# Altium project WindingOne.PrjPcb
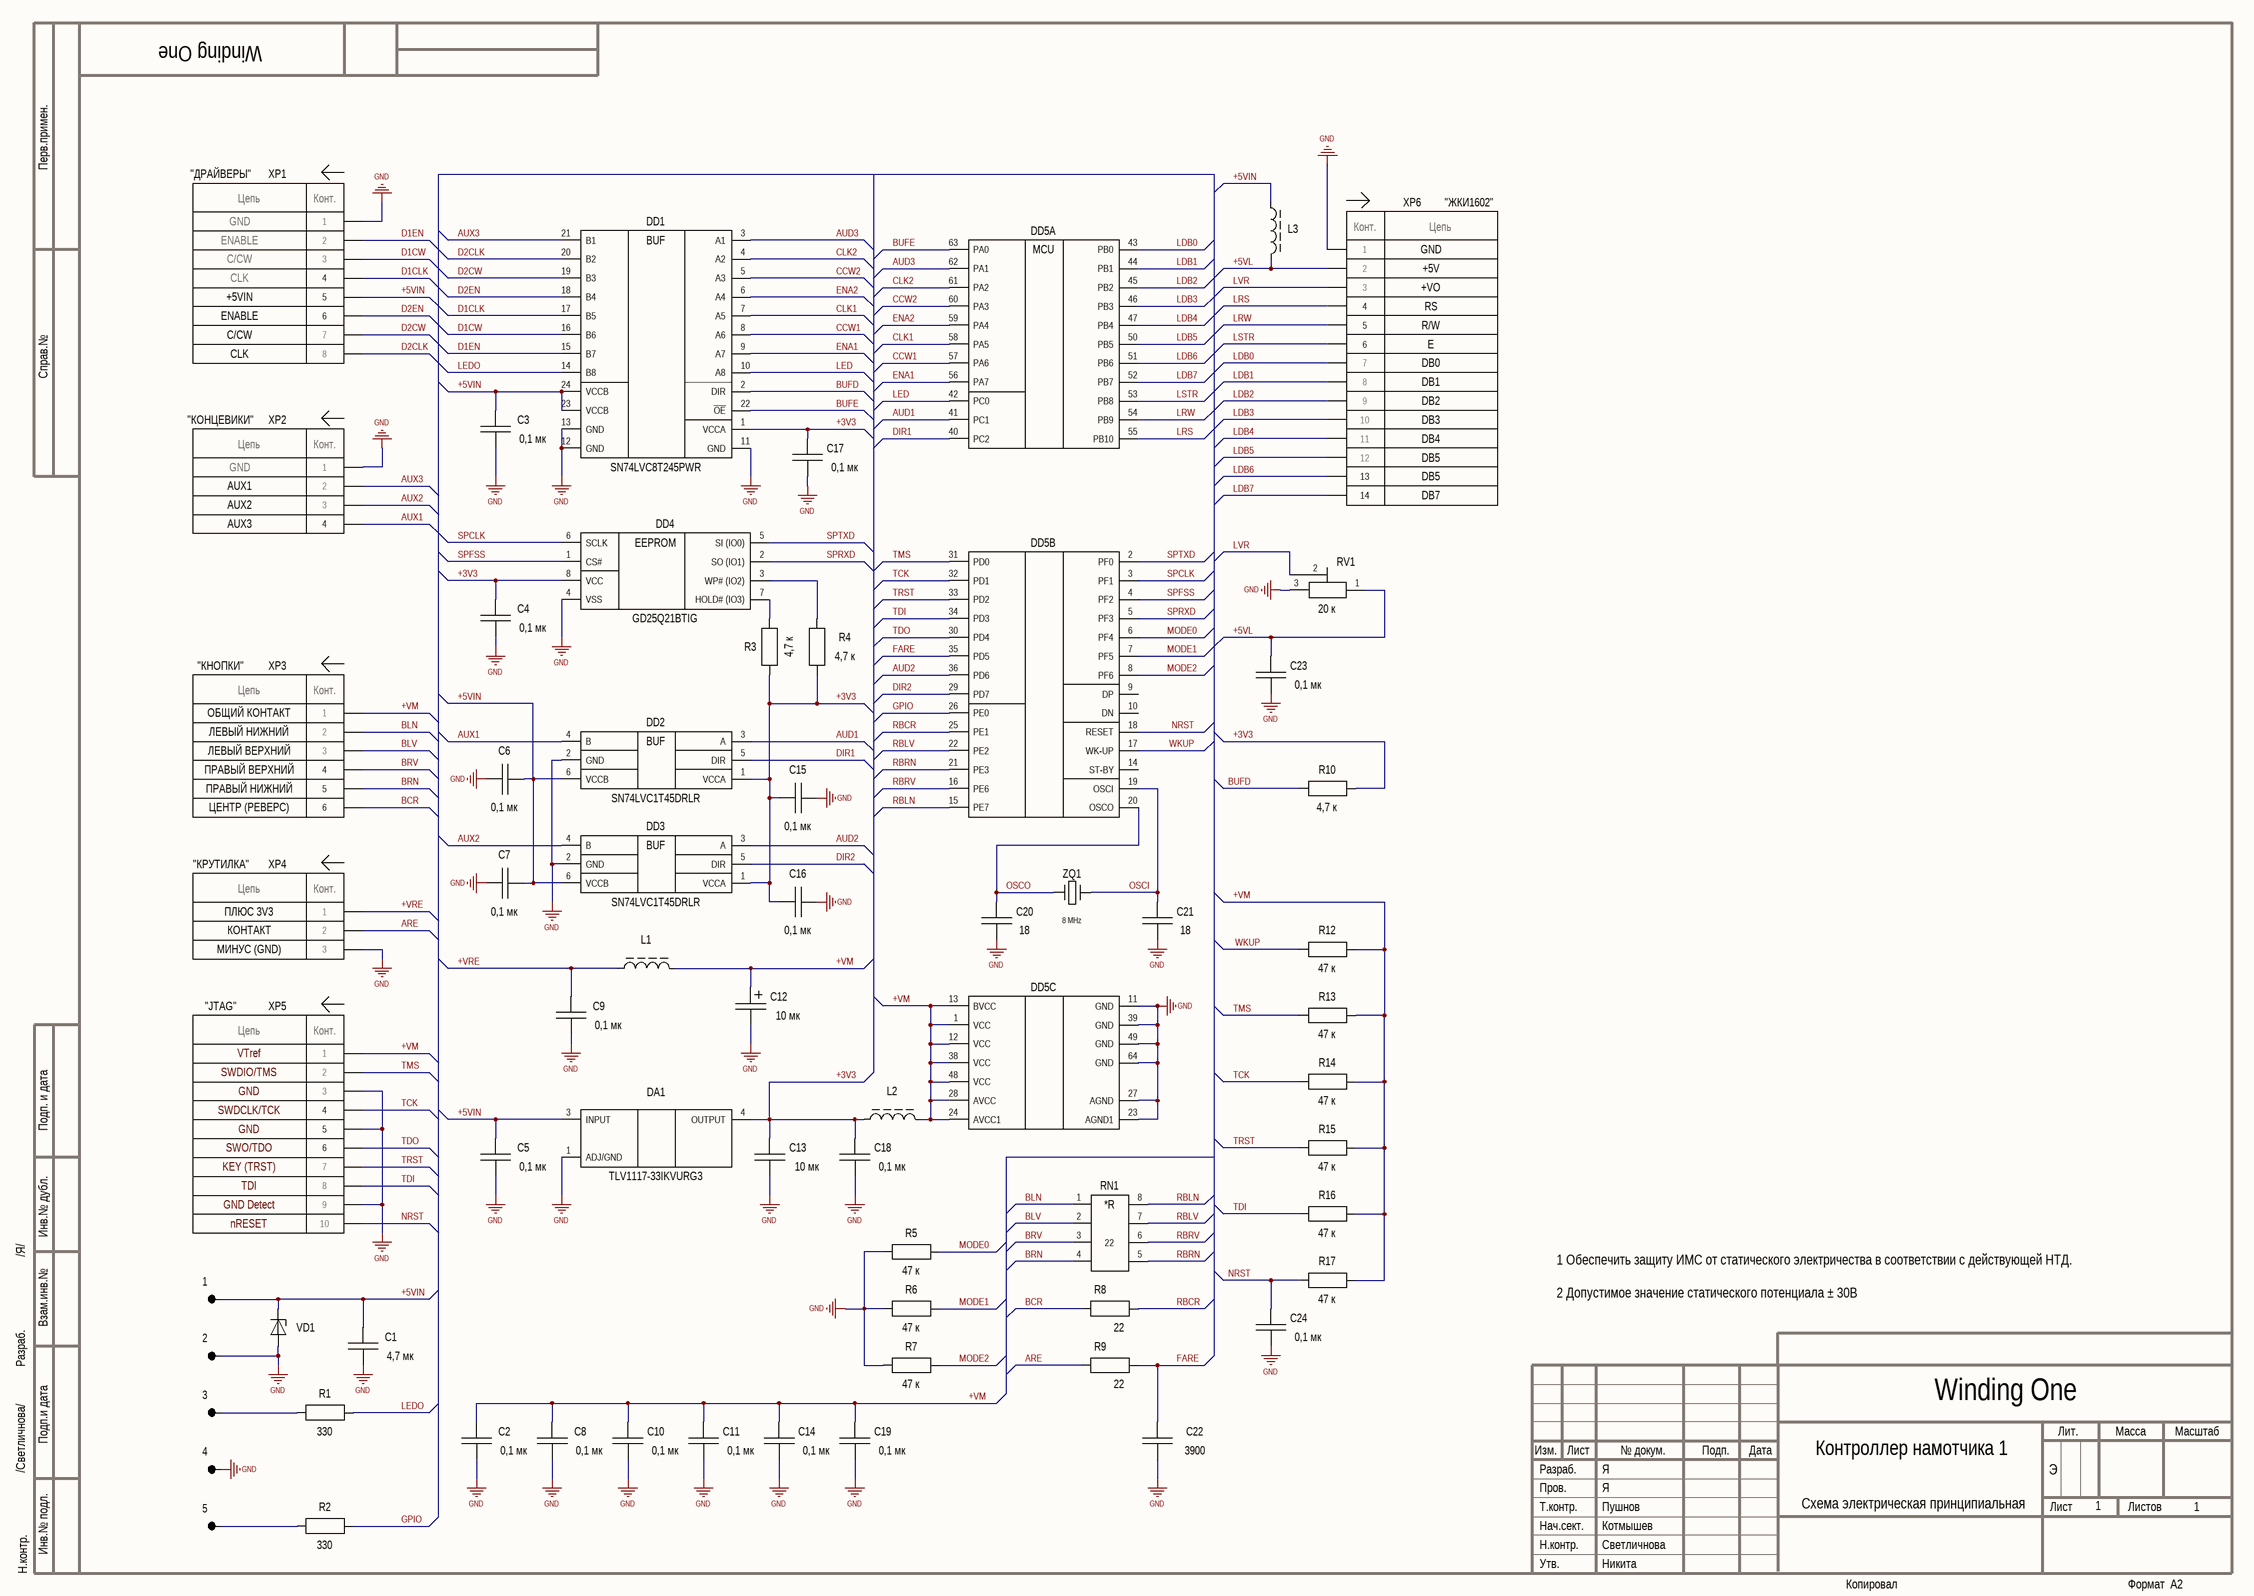
[diagram p0: Wctrl-v1.SchDoc]
1 sheet, 64 parts. Net scope: global (net labels, ports and power ports of the same name join across sheets).
Board file: Wctrl-pcb1.PcbDoc

## Sheet Wctrl-v1.SchDoc
size 594 x 420 mm; ApprovedBy: Никита; CheckedBy: Я; Author: Я; DrawnBy: Светличнова; Engineer: Пушнов; SheetNumber: 1; SheetTotal: 1; Обозначение: Winding One; Литера: Э; Наименование: Контроллер намотчика 1; SchematicType: Схема электрическая принципиальная; HeadOfSector: Котмышев

### Parts
1  Точка пайки  [Pad X 1.0 Round]  (value not drawn)  (no BOM)
2  Точка пайки  [Pad X 1.0 Round]  (value not drawn)  (no BOM)
3  Точка пайки  [Pad X 1.0 Round]  (value not drawn)  (no BOM)
4  Точка пайки  [Pad X 1.0 Round]  (value not drawn)  (no BOM)
5  Точка пайки  [Pad X 1.0 Round]  (value not drawn)  (no BOM)
C1  Capacitance: 4,7 мк  [GRM31C R1]  (hidden comment: GRM31CR71E475K)
C2  Capacitance: 0,1 мк  [CAPC 0805 T1]  (hidden comment: GRM21BR71H104K)
C3  Capacitance: 0,1 мк  [CAPC 0805 T1]  (hidden comment: GRM21BR71H104K)
C4  Capacitance: 0,1 мк  [CAPC 0805 T1]  (hidden comment: GRM21BR71H104K)
C5  Capacitance: 0,1 мк  [CAPC 0805 T1]  (hidden comment: GRM21BR71H104K)
C6  Capacitance: 0,1 мк  [CAPC 0805 T1]  (hidden comment: GRM21BR71H104K)
C7  Capacitance: 0,1 мк  [CAPC 0805 T1]  (hidden comment: GRM21BR71H104K)
C8  Capacitance: 0,1 мк  [CAPC 0805 T1]  (hidden comment: GRM21BR71H104K)
C9  Capacitance: 0,1 мк  [CAPC 0805 T1]  (hidden comment: GRM21BR71H104K)
C10  Capacitance: 0,1 мк  [CAPC 0805 T1]  (hidden comment: GRM21BR71H104K)
C11  Capacitance: 0,1 мк  [CAPC 0805 T1]  (hidden comment: GRM21BR71H104K)
C12  Capacitance: 10 мк  [К53-68-C]  (hidden comment: К53-68 "C"-20В-10 мкФ±10%)
C13  Capacitance: 10 мк  [GRM31C R1]  (hidden comment: GRM31CR71C106K)
C14  Capacitance: 0,1 мк  [CAPC 0805 T1]  (hidden comment: GRM21BR71H104K)
C15  Capacitance: 0,1 мк  [CAPC 0805 T1]  (hidden comment: GRM21BR71H104K)
C16  Capacitance: 0,1 мк  [CAPC 0805 T1]  (hidden comment: GRM21BR71H104K)
C17  Capacitance: 0,1 мк  [CAPC 0805 T1]  (hidden comment: GRM21BR71H104K)
C18  Capacitance: 0,1 мк  [CAPC 0805 T1]  (hidden comment: GRM21BR71H104K)
C19  Capacitance: 0,1 мк  [CAPC 0805 T1]  (hidden comment: GRM21BR71H104K)
C20  Capacitance: 18  [CAPC 0603 T1]  (hidden comment: GRM1885C1H180J)
C21  Capacitance: 18  [CAPC 0603 T1]  (hidden comment: GRM1885C1H180J)
C22  Capacitance: 3900  [CAPC 0805 T1]  (hidden comment: GRM2165C1H392J)
C23  Capacitance: 0,1 мк  [CAPC 0805 T1]  (hidden comment: GRM21BR71H104K)
C24  Capacitance: 0,1 мк  [CAPC 0805 T1]  (hidden comment: GRM21BR71H104K)
DA1  TLV1117-33IKVURG3  [TO-252_TI_KVU (KVU0003A)_R1]
DD1  SN74LVC8T245PWR  [TSSOP24_TI_PW (PW0024A)]
DD2  SN74LVC1T45DRLR  [SOT-5x3_TI_DRL(R-PDSO-N6)]
DD3  SN74LVC1T45DRLR  [SOT-5x3_TI_DRL(R-PDSO-N6)]
DD4  GD25Q21BTIG  [SOIC-8 IPC N]
DD5  К1986ВЕ92QI  [К1986ВЕ92QI]  (value not drawn)  (parts A,B,C of 3)
L1  Дроссель BLM  [INDC2012X10N]  (value not drawn)
L2  Дроссель BLM  [INDC2012X10N]  (value not drawn)
L3  Дроссель BLM  [INDC2012X10N]  (value not drawn)
R1  Resistance: 330  [IEC 2012N]  (hidden comment: Резистор)
R2  Resistance: 330  [IEC 2012N]  (hidden comment: Резистор)
R3  Resistance: 4,7 к  [IEC 2011N]  (hidden comment: Резистор)
R4  Resistance: 4,7 к  [IEC 2011N]  (hidden comment: Резистор)
R5  Resistance: 47 к  [IEC 2011N]  (hidden comment: Резистор)
R6  Resistance: 47 к  [IEC 2011N]  (hidden comment: Резистор)
R7  Resistance: 47 к  [IEC 2011N]  (hidden comment: Резистор)
R8  Resistance: 22  [IEC 2011N]  (hidden comment: Резистор)
R9  Resistance: 22  [IEC 2011N]  (hidden comment: Резистор)
R10  Resistance: 4,7 к  [IEC 2011N]  (hidden comment: Резистор)
R12  Resistance: 47 к  [IEC 2011N]  (hidden comment: Резистор)
R13  Resistance: 47 к  [IEC 2011N]  (hidden comment: Резистор)
R14  Resistance: 47 к  [IEC 2011N]  (hidden comment: Резистор)
R15  Resistance: 47 к  [IEC 2011N]  (hidden comment: Резистор)
R16  Resistance: 47 к  [IEC 2011N]  (hidden comment: Резистор)
R17  Resistance: 47 к  [IEC 2011N]  (hidden comment: Резистор)
RN1  Resistance: 22  [НР1-2Р V1]  (hidden comment: CAT16-220J4LF)
RV1  Resistance: 20 к  [3313J-1]  (hidden comment: Резистор подстроечный)
VD1  Стабилитрон  [SMBJ-LF-R1]  (value not drawn)
XP1  Назначение: "ДРАЙВЕРЫ"  [СНП346-8ВП21-1]  (hidden comment: X8 Connector XP)
XP2  Назначение: "КОНЦЕВИКИ"  [СНП346-4ВП21-1]  (hidden comment: X4 Connector XP)
XP3  Назначение: "КНОПКИ"  [СНП346-6ВП21-1]  (hidden comment: X6 Connector XP)
XP4  Назначение: "КРУТИЛКА"  [СНП346-3ВП21-1]  (hidden comment: X3 Connector XP)
XP5  Назначение: "JTAG"  [DS1014-10SF1B]  (hidden comment: X10 Connector XP)
XP6  Назначение: "ЖКИ1602"  [DS1025-01-1X14]  (hidden comment: X14 Connector XP)
ZQ1  Частота: 8 MHz  [HC-49S AS TXC]  (hidden comment: Кварц 2к)

### Nets
GND: 2.1 4.1 C1.1 C2.1 C3.1 C4.1 C5.1 C6.2 C7.2 C8.1 C9.1 C10.1 C11.1 C12.2 C13.1 C14.1 C15.1 C16.1 C17.1 C18.1 C19.1 C20.1 C21.1 C22.1 C23.1 C24.1 DA1.1(ADJ/GND) DD1.11(GND) DD1.12(GND) DD1.13(GND) DD2.2(GND) DD3.2(GND) DD4.4(VSS) DD5.11(GND) DD5.23(AGND1) DD5.27(AGND) DD5.39(GND) DD5.49(GND) DD5.64(GND) R5.1 R6.1 R7.1 RV1.3 VD1.2(Анод) XP1.1 XP2.1 XP4.3 XP5.3 XP5.5 XP5.9 XP6.1
+3V3: C4.2 C13.2 C15.2 C16.2 C17.2 C18.2 DA1.4(OUTPUT) DD1.1(VCCA) DD2.1(VCCA) DD3.1(VCCA) DD4.8(VCC) L2.1 R3.1 R4.1 R10.2
+5VIN: 1.1 C1.2 C3.2 C5.2 C6.1 C7.1 DA1.3(INPUT) DD1.23(VCCB) DD1.24(VCCB) DD2.6(VCCB) DD3.6(VCCB) L3.1 VD1.1(Катод) XP1.5
+5VL: C23.2 L3.2 RV1.1 XP6.2
+VM: C2.2 C8.2 C10.2 C11.2 C12.1 C14.2 C19.2 DD5.1(VCC) DD5.12(VCC) DD5.13(BVCC) DD5.24(AVCC1) DD5.28(AVCC) DD5.38(VCC) DD5.48(VCC) L1.2 L2.2 R12.2 R13.2 R14.2 R15.2 R16.2 R17.2 XP3.1 XP5.1
+VRE: C9.2 L1.1 XP4.1
ARE: R9.1 XP4.2
AUD1: DD2.3(A) DD5.41(PC1)
AUD2: DD3.3(A) DD5.36(PD6)
AUD3: DD1.3(A1) DD5.62(PA1)
AUX1: DD2.4(B) XP2.4
AUX2: DD3.4(B) XP2.3
AUX3: DD1.21(B1) XP2.2
BCR: R8.1 XP3.6
BLN: RN1.1 XP3.2
BLV: RN1.2 XP3.3
BRN: RN1.4 XP3.5
BRV: RN1.3 XP3.4
BUFD: DD1.2(DIR) R10.1
BUFE: DD1.22(~{OE}) DD5.63(PA0)
CCW1: DD1.8(A6) DD5.57(PA6)
CCW2: DD1.5(A3) DD5.60(PA3)
CLK1: DD1.7(A5) DD5.58(PA5)
CLK2: DD1.4(A2) DD5.61(PA2)
D1CLK: DD1.17(B5) XP1.4
D1CW: DD1.16(B6) XP1.3
D1EN: DD1.15(B7) XP1.2
D2CLK: DD1.20(B2) XP1.8
D2CW: DD1.19(B3) XP1.7
D2EN: DD1.18(B4) XP1.6
DIR1: DD2.5(DIR) DD5.40(PC2)
DIR2: DD3.5(DIR) DD5.29(PD7)
ENA1: DD1.9(A7) DD5.56(PA7)
ENA2: DD1.6(A4) DD5.59(PA4)
FARE: C22.2 DD5.35(PD5) R9.2
GPIO: DD5.26(PE0) R2.2
LDB0: DD5.43(PB0) XP6.7
LDB1: DD5.44(PB1) XP6.8
LDB2: DD5.45(PB2) XP6.9
LDB3: DD5.46(PB3) XP6.10
LDB4: DD5.47(PB4) XP6.11
LDB5: DD5.50(PB5) XP6.12
LDB6: DD5.51(PB6) XP6.13
LDB7: DD5.52(PB7) XP6.14
LED: DD1.10(A8) DD5.42(PC0)
LEDO: DD1.14(B8) R1.2
LRS: DD5.55(PB10) XP6.4
LRW: DD5.54(PB9) XP6.5
LSTR: DD5.53(PB8) XP6.6
LVR: RV1.2 XP6.3
MODE0: DD5.6(PF4) R5.2
MODE1: DD5.7(PF5) R6.2
MODE2: DD5.8(PF6) R7.2
NRST: C24.2 DD5.18(RESET) R17.1 XP5.10
OSCI: C21.2 DD5.19(OSCI) ZQ1.2
OSCO: C20.2 DD5.20(OSCO) ZQ1.1
RBCR: DD5.25(PE1) R8.2
RBLN: DD5.15(PE7) RN1.8
RBLV: DD5.22(PE2) RN1.7
RBRN: DD5.21(PE3) RN1.5
RBRV: DD5.16(PE6) RN1.6
SPCLK: DD4.6(SCLK) DD5.3(PF1)
SPFSS: DD4.1(CS#) DD5.4(PF2)
SPRXD: DD4.2(SO_(IO1)) DD5.5(PF3)
SPTXD: DD4.5(SI_(IO0)) DD5.2(PF0)
TCK: DD5.32(PD1) R14.1 XP5.4
TDI: DD5.34(PD3) R16.1 XP5.8
TDO: DD5.30(PD4) XP5.6
TMS: DD5.31(PD0) R13.1 XP5.2
TRST: DD5.33(PD2) R15.1 XP5.7
WKUP: DD5.17(WK-UP) R12.1
Net3_1: 3.1 R1.1
Net5_1: 5.1 R2.1
NetDD4_3: DD4.3(WP#_(IO2)) R4.2
NetDD4_7: DD4.7(HOLD#_(IO3)) R3.2

Not connected (* = marked no-connect by the designer): DD5 9(DP) 10(DN) 14(ST-BY)

### Notes on the sheet
- GND
- ENABLE
- C/CW
- +5V
- CLK
- +5VIN
- +VO
- RS
- R/W
- E
- DB0
- DB1
- DB2
- DB3
- DB4
- DB5
- AUX1
- AUX2
- DB7
- AUX3
- ОБЩИЙ КОНТАКТ
- ЛЕВЫЙ НИЖНИЙ
- ЛЕВЫЙ ВЕРХНИЙ
- ПРАВЫЙ ВЕРХНИЙ
- ПРАВЫЙ НИЖНИЙ
- ЦЕНТР (РЕВЕРС)
- ПЛЮС 3V3
- КОНТАКТ
- МИНУС (GND)
- VTref
- SWDIO/TMS
- SWDCLK/TCK
- SWO/TDO
- KEY (TRST)
- TDI
- GND Detect
- nRESET
- 1 Обеспечить защиту ИМС от статического электричества в соответствии с действующей НТД.
  2 Допустимое значение статического потенциала ± 30В
- Перв.примен.
- Справ.№
- Подп. и дата
- Инв.№ дубл.
- Взам.инв.№
- Разраб.
- Подп.и дата
- Изм.
- Лист
- № докум.
- Подп.
- Дата
- Лит.
- Масса
- Масштаб
- Т.контр.
- Пров.
- Листов
- Инв.№ подл.
- Утв.
- Н.контр.
- Нач.сект.
- Копировал
- Формат  A2
- (in symbol 1009855) *R
- (in symbol 6000008, part A) MCU
- (in symbol 6000189) BUF
- (in symbol 6000282) EEPROM
- (in symbol 6000343) BUF
- (in symbol 7000007) Цепь; Конт.
- (in symbol 7000008) Цепь; Конт.
- (in symbol 7000010) Цепь; Конт.
- (in symbol 7000012) Цепь; Конт.
- (in symbol 7000059) Цепь; Конт.
- (in symbol 7000095) Конт.; Цепь

### Library data of the parts
1-5 = 7000042: Part Number: Точка п; CompClass: _; Grade: Неизвестно; Mass: 0; CompSource: Покупное; Full Name: _ Точка п; CompID: 7000042; DateStamp: 09.09.2020 15:49:02; ComponentLink1Description: Описание; ComponentLink1URL: \\srv-4\AltiumBase$\Datasheets\Переключатель ПКн159 АУБК.642130.004 ТУ (ОТК).pdf
C1 = 2000751: 10 мкФ ±10% X7R 25В, 1206 (3,2x1,6мм); TU_Manufacturer: ф. Murata, Япония; Value: 4.7u; Group1: Постоянный; CompSource: Покупное; Full Name: Конденсатор GRM31CR71E475K ф. Murata, Япония; BomSection: Прочие изделия; Part Number: GRM31CR71E475K; CompID: 2000751; CompClass: Конденсатор; Mount: Поверхностный; DateStamp: 25.10.2019 17:08:07; Tolerance: ±10%; MaxVoltage: 25 В; Dielectric: X7R; ComponentLink1Description: Описание серии; ComponentLink1URL: \\srv-4\AltiumBase$\Datasheets\Murata Chip Monolithic Ceramic Capacitors.pdf
C2-C11 C14-C19 C23 C24 = 2000024: 0,1 мкФ ±10% X7R 50В (2,0х1,25 мм); TU_Manufacturer: ф. Murata, Япония; Value: 0.1u; Group1: Постоянный; CompSource: Покупное; Full Name: Конденсатор GRM21BR71H104K ф. Murata, Япония; BomSection: Прочие изделия; Part Number: GRM21BR71H104K; CompID: 2000024; CompClass: Конденсатор; Mount: Поверхностный; DateStamp: 21.01.2019 16:24:00; Tolerance: ±10%; MaxVoltage: 50 В; Dielectric: X7R; ComponentLink1Description: Описание серии; ComponentLink1URL: \\srv-4\AltiumBase$\Datasheets\Murata Chip Monolithic Ceramic Capacitors.pdf
C12 = 2000516: Танталовый, тип C; TU_Manufacturer: АЖЯР.673546.007 ТУ; Value: 10u; CompClass: Конденсатор; Group1: Постоянный; Grade: ВП; Mass: 0,3; CompSource: Покупное; Full Name: Конденсатор К53-68 "C"-20В-10 мкФ±10% АЖЯР.673546.007 ТУ; Tolerance: ±10%; MaxVoltage: 20 B; BomSection: Прочие изделия; CompID: 2000516; Part Number: К53-68 "C"-20В-10 мкФ±10%; Mount: Поверхностный; DateStamp: 28.08.2017 13:59:17; ComponentLink1Description: Описание; ComponentLink1URL: \\srv-4\AltiumBase$\Datasheets\Конденсатор К53-68 АЖЯР.673546.007 (Описание).pdf; ComponentLink2Description: Технические условия; ComponentLink2URL: \\srv-4\AltiumBase$\Datasheets\Конденсатор К53-68 АЖЯР.673546.007 ТУ.PDF
C13 = 2000746: 10 мкФ, ±10% X7R 16В, 1206 (3,2x1,6x1,6 мм); TU_Manufacturer: ф. Murata, Япония; Value: 10u; Group1: Постоянный; Grade: Military; CompSource: Покупное; Full Name: Конденсатор GRM31CR71C106K ф. Murata, Япония; BomSection: Прочие изделия; Part Number: GRM31CR71C106K; CompID: 2000746; CompClass: Конденсатор; Mount: Поверхностный; DateStamp: 26.07.2019 16:08:08; Tolerance: ±10%; MaxVoltage: 16 В; Dielectric: X7R; ComponentLink1Description: Описание серии; ComponentLink1URL: \\srv-4\AltiumBase$\Datasheets\Murata Chip Monolithic Ceramic Capacitors.pdf; ComponentLink2Description: Описание серии; ComponentLink2URL: \\srv-4\AltiumBase$\Datasheets\Murata Chip Multilayer Ceramic Capacitors for General_Nov.27,2017.pdf
C20 C21 = 2000015: 18 пФ ±5% C0G 50В (1,6x0,8мм); TU_Manufacturer: ф. Murata, Япония; Value: 18; Group1: Постоянный; CompSource: Покупное; Full Name: Конденсатор GRM1885C1H180J ф. Murata, Япония; BomSection: Прочие изделия; Part Number: GRM1885C1H180J; CompID: 2000015; CompClass: Конденсатор; Mount: Поверхностный; DateStamp: 16.07.2019 14:41:21; Tolerance: ±5%; MaxVoltage: 50 В; Dielectric: C0G; ComponentLink1Description: Описание серии; ComponentLink1URL: \\srv-4\AltiumBase$\Datasheets\Murata Chip Monolithic Ceramic Capacitors.pdf
C22 = 2000921: 3900 пФ ±5% C0G 50В (2,0х1,25 мм); TU_Manufacturer: ф. Murata, Япония; Value: 3900; Group1: Постоянный; CompSource: Покупное; Full Name: Конденсатор GRM2165C1H392J ф. Murata, Япония; BomSection: Прочие изделия; Part Number: GRM2165C1H392J; CompID: 2000921; CompClass: Конденсатор; Mount: Поверхностный; DateStamp: 30.08.2021 19:07:48; Tolerance: ±5%; MaxVoltage: 50 В; Dielectric: C0G; ComponentLink1Description: Описание серии; ComponentLink1URL: \\srv-4\AltiumBase$\Datasheets\Murata Chip Monolithic Ceramic Capacitors.pdf
DA1 = 6000109: 3,3V Fixed Low-Dropout Voltage Regulator, TO-252; TU_Manufacturer: ф. Texas Instruments, США; CompClass: Микросхема; Group1: Стабилизатор; Grade: Industrial; Mass: 1; CompSource: Покупное; Full Name: Микросхема TLV1117-33IKVURG3 ф. Texas Instruments, США; BomSection: Прочие изделия; CompID: 6000109; Part Number: TLV1117-33IKVURG3; Mount: Поверхностный; DateStamp: 23.10.2020 11:46:57; ComponentLink1Description: Datasheet; ComponentLink1URL: \\srv-4\AltiumBase$\Datasheets\Микросхема TLV1117 ф. Texas Instruments.pdf
DD1 = 6000343: Dual-Supply Bus Transceiver (8-bit) with 3-State Outputs, TSSOP-24; TU_Manufacturer: ф. Texas Instruments, США; CompClass: Микросхема; Group1: Буфер; Grade: Industrial; Mass: 0.5; CompSource: Покупное; Full Name: Микросхема SN74LVC8T245PWR ф. Texas Instruments, США; BomSection: Прочие изделия; CompID: 6000343; Part Number: SN74LVC8T245PWR; Mount: Поверхностный; DateStamp: 21.10.2020 20:41:47; ComponentLink1Description: Лист данных; ComponentLink1URL: \\srv-4\AltiumBase$\Datasheets\Микросхема SN74LVC8T245PWR ф. Texas Instruments, США.pdf
DD2 DD3 = 6000189: Single-Bit Dual-Supply Bus Transceiver With Configurable Voltage Translation and 3-State Outputs; TU_Manufacturer: ф. Texas Instruments, США; CompClass: Микросхема; Group1: Трансивер; Grade: Industrial; CompSource: Покупное; Full Name: Микросхема SN74LVC1T45DRLR ф. Texas Instruments, США; BomSection: Прочие изделия; CompID: 6000189; Part Number: SN74LVC1T45DRLR; Mount: Поверхностный; DateStamp: 18.08.2020 17:15:56; ComponentLink1Description: Datasheet; ComponentLink1URL: \\srv-4\AltiumBase$\Datasheets\Микросхема SN74LVC1T45 ф.Texas Instruments.pdf
DD4 = 6000282: Serial Flash 2M-bit, [SPI x 1 / x 2 / x 4], 3,3V, 104 MHz, SOP8; TU_Manufacturer: ф. GigaDevice, Китай; CompClass: Микросхема; Group1: ПЗУ; Grade: Industrial; CompSource: Покупное; Full Name: Микросхема GD25Q21BTIG ф. GigaDevice, Китай; BomSection: Прочие изделия; CompID: 6000282; Part Number: GD25Q21BTIG; Mount: Поверхностный; DateStamp: 19.08.2020 15:13:02; ComponentLink1Description: Datasheet; ComponentLink1URL: \\srv-4\AltiumBase$\Datasheets\Микросхема GD25Q21B ф. GigaDevice, Китай.pdf
DD5 = 6000008: МК, 32-битное ядро ARM Cortex M3 80 МГц, LQFP64; TU_Manufacturer: АЕЯР.431290.711 ТУ; CompClass: Микросхема; Group1: Микроконтроллер; Grade: ОТК; CompSource: Покупное; Full Name: Микросхема К1986ВЕ92QI АЕЯР.431290.711 ТУ; BomSection: Прочие изделия; CompID: 6000008; Part Number: К1986ВЕ92QI; Mount: Поверхностный; DateStamp: 05.10.2020 17:56:44; ComponentLink1Description: Спецификация; ComponentLink1URL: \\srv-4\AltiumBase$\Datasheets\Микросхема 1986ВЕ9X АЕЯР.431290.711 ТУ.pdf
L1-L3 = 3000459: Chip Ferrite Bead BLM21_SN series - 200 mA, 470 Ohm (@100 MHz), 0805; Part Number: BLM21AG471SN1; TU_Manufacturer: ф. Murata, Япония; Grade: Military; Mass: 0.001; CompSource: Покупное; Full Name: Дроссель BLM21AG471SN1 ф. Murata, Япония; Inductance: н; Tolerance: 25%; MaxCurrent: 0.2 A; DCR: 0.25; Value: n; BomSection: Прочие изделия; CompID: 3000459; CompClass: Дроссель; Mount: Поверхностный; DateStamp: 31.10.2019 19:35:14; ComponentLink1Description: Лист данных; ComponentLink1URL: \\srv-4\AltiumBase$\Datasheets\Дроссели типа BLM21PG, BLM31PG ф. Murata, Япония.pdf; ComponentLink2Description: Описание серии; ComponentLink2URL: \\srv-4\AltiumBase$\Datasheets\Дроссели BLM ф. Murata, США.pdf
R1 R2 = 1001102: Чип-резистор 0805; Part Number: Р1-12-0,125-330 Ом±5%-Т; TU_Manufacturer: АЛЯР.434110.005 ТУ; Value: 330; MaxPower: 0,125 Вт; Group1: Постоянный; Grade: ВП; Mass: 0,01; CompSource: Покупное; Full Name: Резистор Р1-12-0,125-330 Ом±5%-Т АЛЯР.434110.005 ТУ; Tolerance: ±5%; TCR: Т; BomSection: Прочие изделия; CompID: 1001102; CompClass: Резистор; Mount: Поверхностный; DateStamp: 15.05.2017 16:43:07; ComponentLink1Description: Описание; ComponentLink1URL: \\srv-4\AltiumBase$\Datasheets\Резистор Р1-12 АЛЯР.434110.005 ТУ.pdf
R3 R4 R10 = 1000329: Чип-резистор 0603; Part Number: Р1-12-0,1-4,7 кОм±5%-Т; TU_Manufacturer: АЛЯР.434110.005 ТУ; Value: 4.7k; MaxPower: 0,1 Вт; Group1: Постоянный; Grade: ВП; Mass: 0,005; CompSource: Покупное; Full Name: Резистор Р1-12-0,1-4,7 кОм±5%-Т АЛЯР.434110.005 ТУ; Tolerance: ±5%; TCR: Т; BomSection: Прочие изделия; CompID: 1000329; CompClass: Резистор; Mount: Поверхностный; DateStamp: 22.04.2017 17:29:10; ComponentLink1Description: Описание; ComponentLink1URL: \\srv-4\AltiumBase$\Datasheets\Резистор Р1-12 АЛЯР.434110.005 ТУ.pdf
R5-R7 R12-R17 = 1004658: Чип-резистор 0603; Part Number: Р1-12-0,1-47 кОм±1%-М; TU_Manufacturer: АЛЯР.434110.005 ТУ; Value: 47k; MaxPower: 0,1 Вт; Group1: Постоянный; Grade: ВП; Mass: 0,005; CompSource: Покупное; Full Name: Резистор Р1-12-0,1-47 кОм±1%-М АЛЯР.434110.005 ТУ; Tolerance: ±1%; TCR: М; BomSection: Прочие изделия; CompID: 1004658; CompClass: Резистор; Mount: Поверхностный; DateStamp: 31.07.2017 21:00:06; ComponentLink1Description: Описание; ComponentLink1URL: \\srv-4\AltiumBase$\Datasheets\Резистор Р1-12 АЛЯР.434110.005 ТУ.pdf
R8 R9 = 1000273: Чип-резистор 0603; Part Number: Р1-12-0,1-22 Ом±5%-Т; TU_Manufacturer: АЛЯР.434110.005 ТУ; Value: 22; MaxPower: 0,1 Вт; Group1: Постоянный; Grade: ВП; Mass: 0,005; CompSource: Покупное; Full Name: Резистор Р1-12-0,1-22 Ом±5%-Т АЛЯР.434110.005 ТУ; Tolerance: ±5%; TCR: Т; BomSection: Прочие изделия; CompID: 1000273; CompClass: Резистор; Mount: Поверхностный; DateStamp: 22.04.2017 17:29:00; ComponentLink1Description: Описание; ComponentLink1URL: \\srv-4\AltiumBase$\Datasheets\Резистор Р1-12 АЛЯР.434110.005 ТУ.pdf
RN1 = 1009855: Набор резисторов 4шт х 22 Ом, 0,0625 Вт , 50В, 5%, SMD 3.2 x 1.6 x 0.8; TU_Manufacturer: ф. Bourns, США; Device: НР1-2Р-5.1 кОм ±5 %; Specification: ШКАБ.434110.018ТУ; Value: 22; Grade: Industrial; Mass: 0,03; CompSource: Покупное; Full Name: Резистор CAT16-220J4LF ф. Bourns, США; MaxPower: 0,062 Вт; BomSection: Прочие изделия; Title: Набор резисторов; Type: Набор резисторов; CompID: 1009855; Part Number: CAT16-220J4LF; CompClass: Резистор; Group1: Набор резисторов; Mount: Поверхностный; DateStamp: 25.08.2021 19:57:49; Tolerance: ±5%; ComponentLink1Description: Лист данных; ComponentLink1URL: \\srv-4\AltiumBase$\Datasheets\Наборы резисторов CAT16_CAY16_J2_J4LF (BOURNS).pdf; ComponentLink2Description: Отечественный Аналог; ComponentLink2URL: \\srv-4\AltiumBase$\Datasheets\Наборы резисторов НР1-2Р, НР1-3Р, НР1-4Р (лист данных).pdf
RV1 = 1009856: Trimming Potentiometer, 20 kOhm, SMD 3.5 x 3.2 x 2.2; Part Number: 3313J-1-203E; TU_Manufacturer: ф. Bourns, США; Value: 20k; MaxPower: 0,125; Grade: AEC-Q200; Mass: 1; CompSource: Покупное; Full Name: Резистор 3313J-1-203E ф. Bourns, США; Tolerance: ±20%; BomSection: Прочие изделия; CompID: 1009856; CompClass: Резистор; Group1: Подстроечный; Mount: Штырьевой; DateStamp: 06.09.2021 13:21:02; ComponentLink1Description: Описание серии; ComponentLink1URL: \\srv-4\AltiumBase$\Datasheets\Резистор подстроечный 3313J-1 Bourns.pdf
VD1 = 4000045: TVS Diode, Uni-directional, 12V, DO-214AA (SMB J-Bend); Part Number: SMBJ12A; TU_Manufacturer: ф. Littelfuse, США; CompClass: Диод; Group1: Диод защитный; Grade: Military; Mass: 0.093; CompSource: Покупное; Full Name: Диод SMBJ12A ф. Littelfuse, США; BomSection: Прочие изделия; CompID: 4000045; Mount: Поверхностный; DateStamp: 20.11.2018 17:38:45; ComponentLink1Description: Описание серии; ComponentLink1URL: \\srv-4\AltiumBase$\Datasheets\Диоды защитные SMBJ ф. Littelfuse, США.pdf
XP1 = 7000012: Вилка СНП346 однорядная, прямая, 8 контактов; Part Number: СНП346-8ВП21-1-В; TU_Manufacturer: РЮМК.430420.011 ТУ; CompClass: Соединитель; Grade: ВП; Mass: 0,48; CompSource: Покупное; Full Name: Соединитель СНП346-8ВП21-1-В РЮМК.430420.011 ТУ; BomSection: Прочие изделия; CompID: 7000012; Group1: Вилка; Mount: Штырьевой; DateStamp: 06.11.2018 13:53:56; ComponentLink1Description: Технические условия; ComponentLink1URL: \\srv-4\AltiumBase$\Datasheets\Соединители типа СНП346 РЮМК.430420.011ТУ.PDF
XP2 = 7000008: Вилка СНП346 однорядная, прямая, 4 контакта; Part Number: СНП346-4ВП21-1-В; TU_Manufacturer: РЮМК.430420.011 ТУ; CompClass: Соединитель; Grade: ВП; Mass: 0,24; CompSource: Покупное; Full Name: Соединитель СНП346-4ВП21-1-В РЮМК.430420.011 ТУ; BomSection: Прочие изделия; CompID: 7000008; Group1: Вилка; Mount: Штырьевой; DateStamp: 06.11.2018 13:50:24; ComponentLink1Description: Технические условия; ComponentLink1URL: \\srv-4\AltiumBase$\Datasheets\Соединители типа СНП346 РЮМК.430420.011ТУ.PDF
XP3 = 7000010: Вилка СНП346 однорядная, прямая, 6 контактов; Part Number: СНП346-6ВП21-1-В; TU_Manufacturer: РЮМК.430420.011 ТУ; CompClass: Соединитель; Grade: ВП; Mass: 0,36; CompSource: Покупное; Full Name: Соединитель СНП346-6ВП21-1-В РЮМК.430420.011 ТУ; BomSection: Прочие изделия; CompID: 7000010; Group1: Вилка; Mount: Штырьевой; DateStamp: 06.11.2018 13:52:39; ComponentLink1Description: Технические условия; ComponentLink1URL: \\srv-4\AltiumBase$\Datasheets\Соединители типа СНП346 РЮМК.430420.011ТУ.PDF
XP4 = 7000007: Вилка СНП346 однорядная, прямая, 3 контакта; Part Number: СНП346-3ВП21-1-В; TU_Manufacturer: РЮМК.430420.011 ТУ; CompClass: Соединитель; Grade: ВП; Mass: 0,18; CompSource: Покупное; Full Name: Соединитель СНП346-3ВП21-1-В РЮМК.430420.011 ТУ; BomSection: Прочие изделия; CompID: 7000007; Group1: Вилка; Mount: Штырьевой; DateStamp: 06.11.2018 13:49:37; ComponentLink1Description: Технические условия; ComponentLink1URL: \\srv-4\AltiumBase$\Datasheets\Соединители типа СНП346 РЮМК.430420.011ТУ.PDF
XP5 = 7000059: Вилка двухрядная на плату IDC-2-10, прямая, шаг 2  мм, 10 контактов; TU_Manufacturer: ф. Connfly Electronics, Китай; CompClass: Соединитель; Grade: Неизвестно; Mass: 0,6; CompSource: Покупное; Full Name: Соединитель DS1014-10SF1B ф. Connfly Electronics, Китай; BomSection: Прочие изделия; CompID: 7000059; Part Number: DS1014-10SF1B; Group1: Вилка; Mount: Штырьевой; DateStamp: 25.11.2020 21:55:25; ComponentLink1Description: Лист данных; ComponentLink1URL: \\srv-4\AltiumBase$\Datasheets\Соединитель DS1014 ф. Connfly Electronics.pdf; ComponentLink2Description: Описание серии; ComponentLink2URL: \\srv-4\AltiumBase$\Datasheets\Соединители Серии IDC (серия).pdf
XP6 = 7000095: Вилка на плату, прямая, шаг 2,0 мм, 14 контактов; Part Number: DS1025-01*14P8BV2; TU_Manufacturer: ф. Connfly Electronics, Китай; CompClass: Соединитель; Grade: Неизвестно; Mass: 1; CompSource: Покупное; Full Name: Соединитель DS1025-01*14P8BV2 ф. Connfly Electronics, Китай; BomSection: Прочие изделия; CompID: 7000095; Group1: Вилка; Mount: Штырьевой; DateStamp: 06.10.2021 17:25:34; ComponentLink1Description: Лист данных; ComponentLink1URL: \\srv-4\AltiumBase$\Datasheets\Соединитель DS1025-01 ф. Connfly Electronics.pdf; ComponentLink2URL: \\srv-4\AltiumBase$\Datasheets\Соединители PLD PLS (Описание типа).pdf
ZQ1 = 9000047: 8.000 МHz (Tolerance ±30ppm, Stability ±50ppm, Load Capacitance 12 pF); Part Number: AS-8.000MAGE; TU_Manufacturer: ф. TXC Corporation, Тайвань; CompClass: Резонатор; Group1: Резонатор кварцевый; Grade: Automotive; Mass: 2; CompSource: Покупное; Full Name: Резонатор AS-8.000MAGE ф. TXC Corporation, Тайвань; BomSection: Прочие изделия; CompID: 9000047; Mount: Штырьевой; DateStamp: 09.10.2020 16:34:34; ComponentLink1Description: Лист данных; ComponentLink1URL: \\srv-4\AltiumBase$\Datasheets\Кварц HS-49S AS ф. TXC (Datasheet).pdf; ComponentLink2Description: Описание серии; ComponentLink2URL: \\srv-4\AltiumBase$\Datasheets\Кварц HS-49S AS ф. TXC (Number Builder).pdf